# Altium schematic sheet 大风车灯条1.SchDoc
size A4
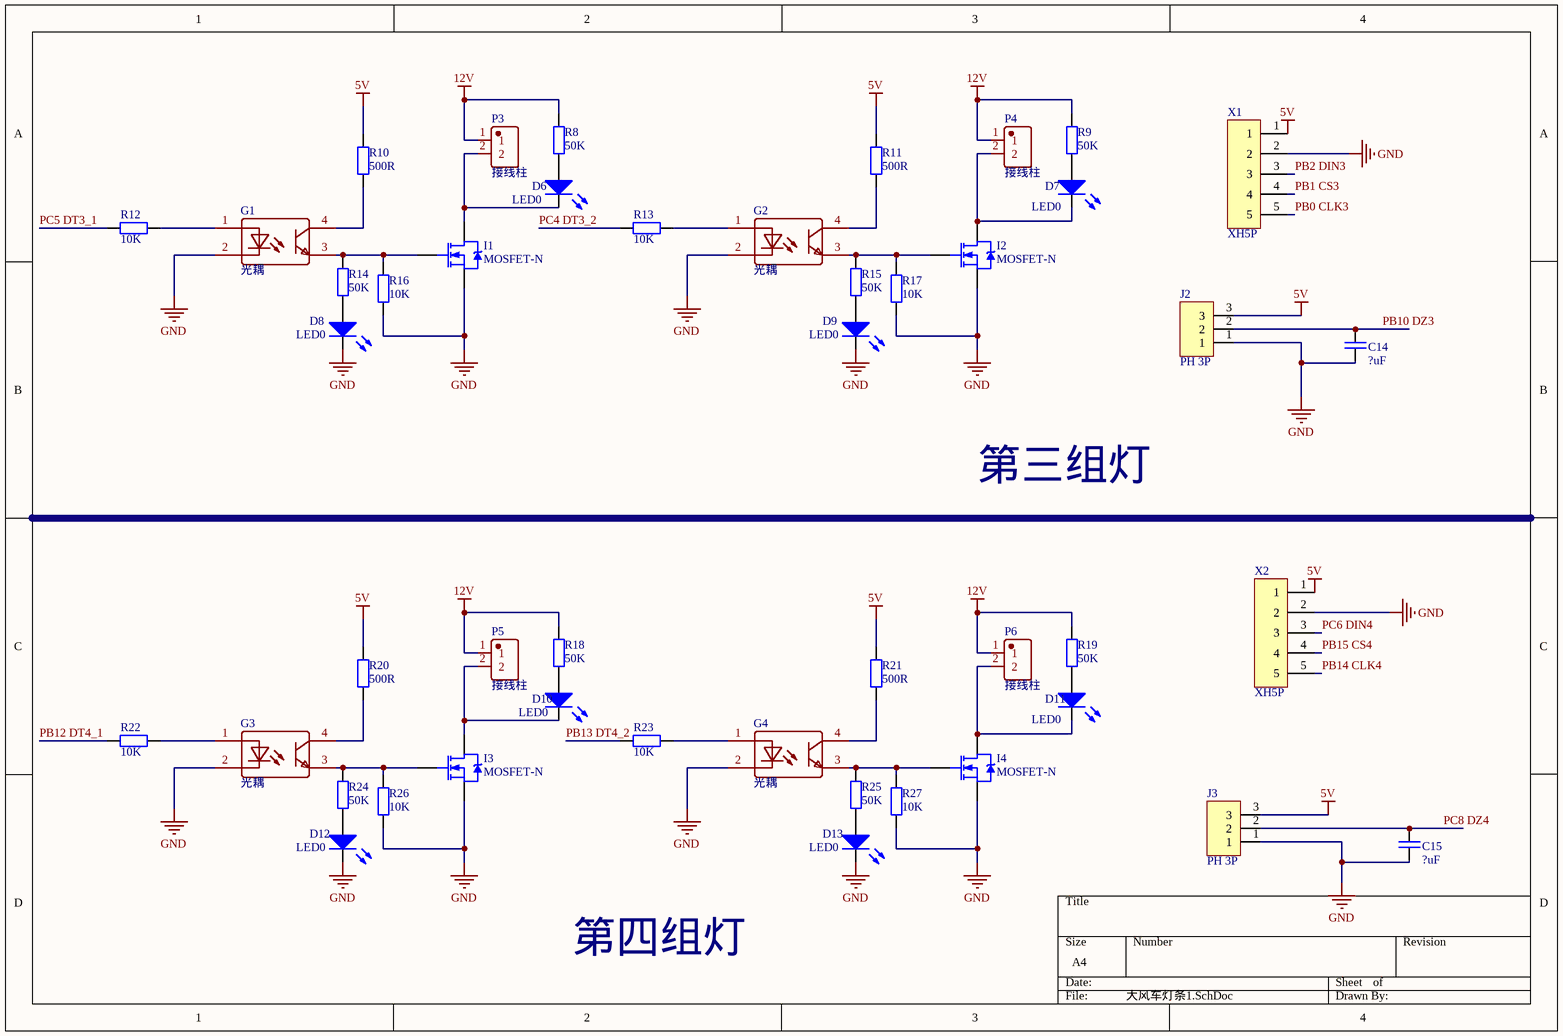
[diagram p0: 大风车灯条1.SchDoc]

## Parts
C14  ?uF  [0603_C]
C15  ?uF  [0603_C]
D6  LED0  [LED-0603]
D7  LED0  [LED-0603]
D8  LED0  [LED-0603]
D9  LED0  [LED-0603]
D10  LED0  [LED-0603]
D11  LED0  [LED-0603]
D12  LED0  [LED-0603]
D13  LED0  [LED-0603]
G1  光耦  [SMD-4]
G2  光耦  [SMD-4]
G3  光耦  [SMD-4]
G4  光耦  [SMD-4]
I1  MOSFET-N  [VSONP-8]
I2  MOSFET-N  [VSONP-8]
I3  MOSFET-N  [VSONP-8]
I4  MOSFET-N  [VSONP-8]
J2  PH 3P  [PH3P]
J3  PH 3P  [PH3P]
P3  接线柱  [XT30-F]
P4  接线柱  [XT30-F]
P5  接线柱  [XT30-F]
P6  接线柱  [XT30-F]
R8  50K  [0603_R]
R9  50K  [0603_R]
R10  500R  [0603_R]
R11  500R  [0603_R]
R12  10K  [0603_R]
R13  10K  [0603_R]
R14  50K  [0603_R]
R15  50K  [0603_R]
R16  10K  [0603_R]
R17  10K  [0603_R]
R18  50K  [0603_R]
R19  50K  [0603_R]
R20  500R  [0603_R]
R21  500R  [0603_R]
R22  10K  [0603_R]
R23  10K  [0603_R]
R24  50K  [0603_R]
R25  50K  [0603_R]
R26  10K  [0603_R]
R27  10K  [0603_R]
X1  XH5P  [XH5P]
X2  XH5P  [XH5P]

## Nets
5V: J2.3 J3.3 R10.2 R11.2 R20.2 R21.2 X1.1 X2.1
12V: P3.1 P4.1 P5.1 P6.1 R8.2 R9.2 R18.2 R19.2
GND: C14.1 C15.1 D8.2(K) D9.2(K) D12.2(K) D13.2(K) G1.2(CAT) G2.2(CAT) G3.2(CAT) G4.2(CAT) I1.S I2.S I3.S I4.S J2.1 J3.1 R16.1 R17.1 R26.1 R27.1 X1.2 X2.2
PB0 CLK3: X1.5
PB1 CS3: X1.4
PB2 DIN3: X1.3
PB10 DZ3: C14.2 J2.2
PB12 DT4_1: R22.1
PB13 DT4_2: R23.1
PB14 CLK4: X2.5
PB15 CS4: X2.4
PC4 DT3_2: R13.1
PC5 DT3_1: R12.1
PC6 DIN4: X2.3
PC8 DZ4: C15.2 J3.2
NetD6_1: D6.1(A) R8.1
NetD6_2: D6.2(K) I1.D P3.2
NetD7_1: D7.1(A) R9.1
NetD7_2: D7.2(K) I2.D P4.2
NetD8_1: D8.1(A) R14.1
NetD9_1: D9.1(A) R15.1
NetD10_1: D10.1(A) R18.1
NetD10_2: D10.2(K) I3.D P5.2
NetD11_1: D11.1(A) R19.1
NetD11_2: D11.2(K) I4.D P6.2
NetD12_1: D12.1(A) R24.1
NetD13_1: D13.1(A) R25.1
NetG1_1: G1.1(AN) R12.2
NetG1_3: G1.3(EM) I1.G R14.2 R16.2
NetG1_4: G1.4(COL) R10.1
NetG2_1: G2.1(AN) R13.2
NetG2_3: G2.3(EM) I2.G R15.2 R17.2
NetG2_4: G2.4(COL) R11.1
NetG3_1: G3.1(AN) R22.2
NetG3_3: G3.3(EM) I3.G R24.2 R26.2
NetG3_4: G3.4(COL) R20.1
NetG4_1: G4.1(AN) R23.2
NetG4_3: G4.3(EM) I4.G R25.2 R27.2
NetG4_4: G4.4(COL) R21.1

## Notes on the sheet
- 第三组灯
- 第四组灯

## Library data of the parts
C14 C15 = Cap: Published: 8-Jun-2000; LatestRevisionDate: 17-Jul-2002; LatestRevisionNote: Re-released for DXP Platform.; PackageReference: RAD-0.3; Publisher: Altium Limited
D6-D13 = LED0: 发光二极管; Published: 8-Jun-2000; LatestRevisionDate: 08-Jul-2005; LatestRevisionNote: Mech Layer 1 removed.; PackageReference: LED-0; Publisher: Altium Limited
R8-R27 = Res: Published: 8-Jun-2000; LatestRevisionDate: 17-Jul-2002; LatestRevisionNote: Re-released for DXP Platform.; PackageReference: AXIAL-0.4; Publisher: Altium Limited